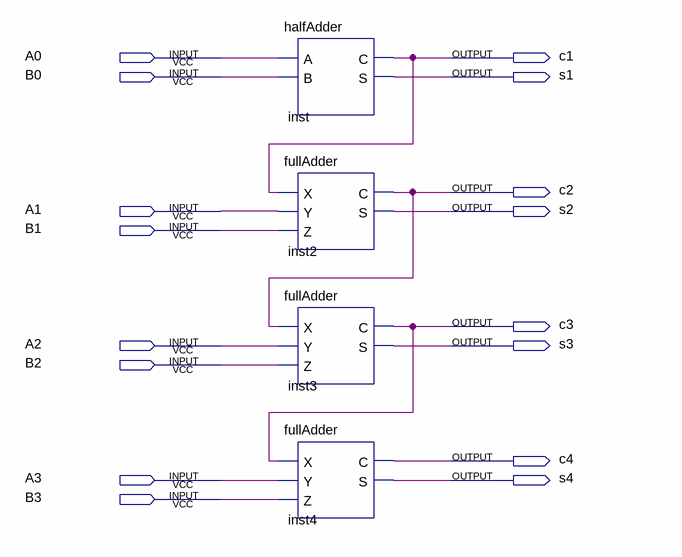
[diagram p0: schematic sheet]
// Quartus schematic rippleCarry.bdf as structural Verilog: 4 symbols, 16 pins
module rippleCarry (
  input  A0,
  input  B0,
  input  A1,
  input  B1,
  input  A2,
  input  B2,
  input  A3,
  input  B3,
  output c1,
  output s1,
  output c2,
  output s2,
  output c3,
  output s3,
  output c4,
  output s4
);

  halfAdder inst (.A(A0), .B(B0), .C(c1), .S(s1));
  fullAdder inst2 (.X(c1), .Y(A1), .Z(B1), .C(c2), .S(s2));
  fullAdder inst3 (.X(c2), .Y(A2), .Z(B2), .C(c3), .S(s3));
  fullAdder inst4 (.X(c3), .Y(A3), .Z(B3), .C(c4), .S(s4));
endmodule
